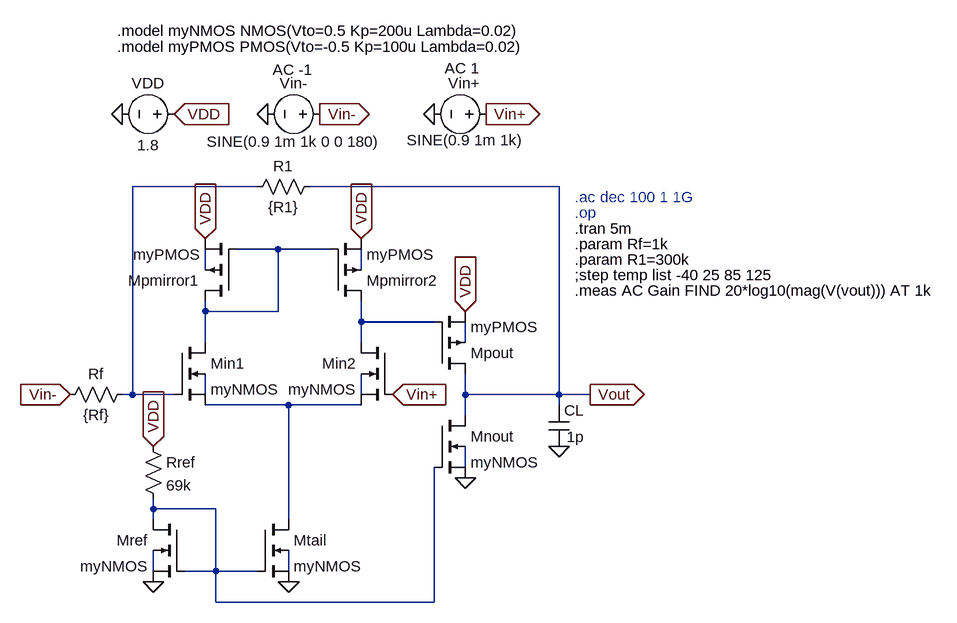
[diagram p0: schematic 2-Stage Miller Op-Amp.asc]
2-Stage Miller Op-Amp.asc, the LTspice schematic file:
Version 4.1
SHEET 1 1316 680
WIRE 224 -160 32 -160
WIRE 688 -160 304 -160
WIRE 256 -64 192 -64
WIRE 336 -64 256 -64
WIRE 144 -32 144 -64
WIRE 384 -32 384 -64
WIRE 144 32 144 16
WIRE 256 32 256 -64
WIRE 256 32 144 32
WIRE 384 48 384 16
WIRE 496 48 384 48
WIRE 144 80 144 32
WIRE 384 80 384 48
WIRE 544 80 544 48
WIRE 32 160 32 -160
WIRE 32 160 16 160
WIRE 96 160 32 160
WIRE 144 160 144 128
WIRE 384 160 384 128
WIRE 544 160 544 128
WIRE 688 160 688 -160
WIRE 688 160 544 160
WIRE 736 160 688 160
WIRE 272 176 144 176
WIRE 384 176 272 176
WIRE 688 176 688 160
WIRE 544 192 544 160
WIRE 544 272 544 240
WIRE 64 336 64 320
WIRE 160 336 64 336
WIRE 64 352 64 336
WIRE 272 352 272 176
WIRE 64 432 64 400
WIRE 160 432 160 336
WIRE 160 432 112 432
WIRE 224 432 160 432
WIRE 272 432 272 400
WIRE 160 480 160 432
WIRE 496 480 496 272
WIRE 496 480 160 480
FLAG 240 -272 0
FLAG 16 -272 0
FLAG 96 -272 VDD
IOPIN 96 -272 In
FLAG 144 -80 VDD
IOPIN 144 -80 In
FLAG 384 -80 VDD
IOPIN 384 -80 In
FLAG 64 240 VDD
IOPIN 64 240 In
FLAG 64 448 0
FLAG 272 448 0
FLAG 496 -272 0
FLAG 544 32 VDD
IOPIN 544 32 In
FLAG 736 160 Vout
IOPIN 736 160 Out
FLAG 320 -272 Vin-
IOPIN 320 -272 Out
FLAG 576 -272 Vin+
IOPIN 576 -272 Out
FLAG -64 160 Vin-
IOPIN -64 160 In
FLAG 432 160 Vin+
IOPIN 432 160 In
FLAG 688 240 0
FLAG 544 288 0
SYMBOL voltage 336 -272 R90
WINDOW 0 -32 56 VBottom 2
WINDOW 3 58 57 VBottom 2
WINDOW 123 -53 58 VBottom 2
WINDOW 39 0 0 Left 0
SYMATTR InstName Vin-
SYMATTR Value SINE(0.9 1m 1k 0 0 180)
SYMATTR Value2 AC -1
SYMBOL voltage 112 -272 R90
WINDOW 0 -32 56 VBottom 2
WINDOW 3 32 56 VTop 2
WINDOW 123 0 0 Left 0
WINDOW 39 0 0 Left 0
SYMATTR InstName VDD
SYMATTR Value 1.8
SYMBOL res 48 224 R0
SYMATTR InstName Rref
SYMATTR Value 69k
SYMBOL voltage 592 -272 R90
WINDOW 0 -63 50 VTop 2
WINDOW 3 56 49 VBottom 2
WINDOW 123 -86 53 VTop 2
WINDOW 39 0 0 Left 0
SYMATTR InstName Vin+
SYMATTR Value SINE(0.9 1m 1k)
SYMATTR Value2 AC 1
SYMBOL cap 672 176 R0
WINDOW 3 28 49 Left 2
SYMATTR Value 1p
SYMATTR InstName CL
SYMBOL res 32 144 R90
WINDOW 0 0 56 VBottom 2
WINDOW 3 32 56 VTop 2
SYMATTR InstName Rf
SYMATTR Value {Rf}
SYMBOL res 320 -176 R90
WINDOW 0 0 56 VBottom 2
WINDOW 3 32 56 VTop 2
SYMATTR InstName R1
SYMATTR Value {R1}
SYMBOL nmos4 112 352 M0
SYMATTR InstName Mref
SYMATTR Value myNMOS
SYMATTR Value2 l=1u w=4u
SYMBOL nmos4 224 352 R0
SYMATTR InstName Mtail
SYMATTR Value myNMOS
SYMATTR Value2 l=1u w=4u
SYMBOL nmos4 432 80 M0
SYMATTR InstName Min2
SYMATTR Value myNMOS
SYMATTR Value2 l=1u w=2u
SYMBOL nmos4 96 80 R0
SYMATTR InstName Min1
SYMATTR Value myNMOS
SYMATTR Value2 l=1u w=2u
SYMBOL pmos4 192 16 R180
SYMATTR InstName Mpmirror1
SYMATTR Value myPMOS
SYMATTR Value2 l=1u w=4u
SYMBOL pmos4 336 16 M180
SYMATTR InstName Mpmirror2
SYMATTR Value myPMOS
SYMATTR Value2 l=1u w=4u
SYMBOL pmos4 496 128 M180
SYMATTR InstName Mpout
SYMATTR Value myPMOS
SYMATTR Value2 l=1u w=4u
SYMBOL nmos4 496 192 R0
SYMATTR InstName Mnout
SYMATTR Value myNMOS
SYMATTR Value2 l=1u w=2u
TEXT 712 -120 Left 2 ;.op
TEXT 712 -96 Left 2 !.tran 5m
TEXT 712 -144 Left 2 ;.ac dec 100 1 1G
TEXT 712 -72 Left 2 !.param Rf=1k
TEXT 712 -48 Left 2 !.param R1=300k
TEXT 8 -400 Left 2 !.model myNMOS NMOS(Vto=0.5 Kp=200u Lambda=0.02)
TEXT 8 -376 Left 2 !.model myPMOS PMOS(Vto=-0.5 Kp=100u Lambda=0.02)
TEXT 712 -24 Left 2 !;step temp list -40 25 85 125
TEXT 712 0 Left 2 !.meas AC Gain FIND 20*log10(mag(V(vout))) AT 1k

The netlist it stands for:
* 2-Stage Miller Op-Amp.asc
Vin- Vin- 0 SINE(0.9 1m 1k 0 0 180) AC -1
VDD VDD 0 1.8
Rref VDD N011 69k
Vin+ Vin+ 0 SINE(0.9 1m 1k) AC 1
CL Vout 0 1p
Rf N001 Vin- {Rf}
R1 Vout N001 {R1}
Mref N011 N011 0 N012 myNMOS l=1u w=4u
Mtail N009 N011 0 N013 myNMOS l=1u w=4u
Min2 N005 Vin+ N009 N008 myNMOS l=1u w=2u
Min1 N002 N001 N009 N007 myNMOS l=1u w=2u
Mpmirror1 N002 N002 VDD N003 myPMOS l=1u w=4u
Mpmirror2 N005 N002 VDD N004 myPMOS l=1u w=4u
Mpout Vout N005 VDD N006 myPMOS l=1u w=4u
Mnout Vout N011 0 N010 myNMOS l=1u w=2u
.model NMOS NMOS
.model PMOS PMOS
.lib standard.mos
* .op
.tran 5m
* .ac dec 100 1 1G
.param Rf=1k
.param R1=300k
.model myNMOS NMOS(Vto=0.5 Kp=200u Lambda=0.02)
.model myPMOS PMOS(Vto=-0.5 Kp=100u Lambda=0.02)
;step temp list -40 25 85 125
.meas AC Gain FIND 20*log10(mag(V(vout))) AT 1k
.backanno
.end